# Altium project NavMergeBoard.PrjPcb
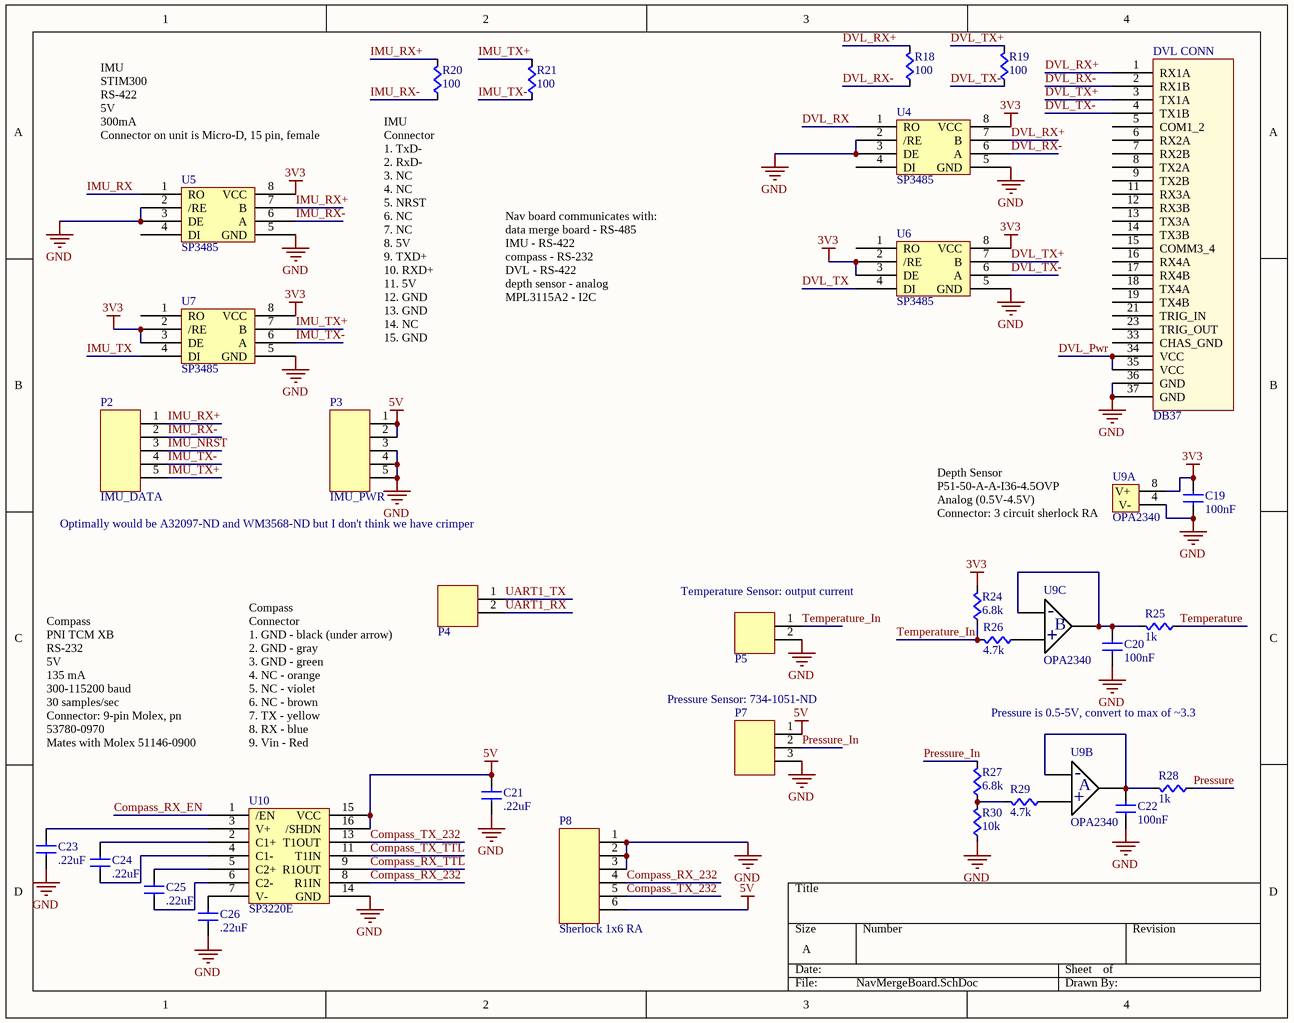
[diagram p0: NavMergeBoard.SchDoc]
4 sheets, 103 parts. Net scope: global (net labels, ports and power ports of the same name join across sheets).
Board files: NavMergeBoard.PcbDoc, NavMergeBoardR2.PcbDoc
Sheets:
  NavMergeBoard.SchDoc
  Power.SchDoc
  CPU.SchDoc
  LEDs.SchDoc

## Sheet NavMergeBoard.SchDoc
size A

### Parts
C19  value 100nF  [CAPC0603]  (hidden comment: Cap)
C20  value 100nF  [CAPC0603]  (hidden comment: Cap)
C21  value .22uF  [CAPC0603]  (hidden comment: Cap)
C22  value 100nF  [CAPC0603]  (hidden comment: Cap)
C23  value .22uF  [CAPC0603]  (hidden comment: Cap)
C24  value .22uF  [CAPC0603]  (hidden comment: Cap)
C25  value .22uF  [CAPC0603]  (hidden comment: Cap)
C26  value .22uF  [CAPC0603]  (hidden comment: Cap)
DVL_CONN  DB37  [DSUB37_ FEMALE]
P2  MOLEX-HDR-1x5-SHERLOCK_RA  [MOLEX-HDR-1X5-SHERLOCK- RA]  (value not drawn)
P3  MOLEX-HDR-1x5-SHERLOCK_RA  [MOLEX-HDR-1X5-SHERLOCK- RA]  (value not drawn)
P4  2-pin Horz Sherlock  [MOLEX-HDR-1X2-SHERLOCK-HORZ]  (value not drawn)
P5  2-pin Horz Sherlock  [MOLEX-HDR-1X2-SHERLOCK-HORZ]  (value not drawn)
P7  3pos RA sherlock connector  [MOLEX-HDR-1X3-SHERLOCK-RA]  (value not drawn)
P8  Sherlock 1x6 RA  [MOLEX-HDR-1X6-SHERLOCK- RA]
R18  value 100  [RES0603]  (hidden comment: Res)
R19  value 100  [RES0603]  (hidden comment: Res)
R20  value 100  [RES0603]  (hidden comment: Res)
R21  value 100  [RES0603]  (hidden comment: Res)
R24  value 6.8k  [RES0603]  (hidden comment: Res)
R25  value 1k  [RES0603]  (hidden comment: Res)
R26  value 4.7k  [RES0603]  (hidden comment: Res)
R27  value 6.8k  [RES0603]  (hidden comment: Res)
R28  value 1k  [RES0603]  (hidden comment: Res)
R29  value 4.7k  [RES0603]  (hidden comment: Res)
R30  value 10k  [RES0603]  (hidden comment: Res)
U4  SP3485  [SP3485]
U5  SP3485  [SP3485]
U6  SP3485  [SP3485]
U7  SP3485  [SP3485]
U9  OPA2340  [OPA2340]  (parts A,B,C of 3)
U10  SP3220E  [SP3220ECY-L/TR]

### Nets
3V3: C19.1(A) R24.1(A) U4.8(VCC) U5.8(VCC) U6.2(/RE) U6.3(DE) U6.8(VCC) U7.2(/RE) U7.3(DE) U7.8(VCC) U9.8(V+)
5V: C21.1(A) P3.1 P3.2 P7.1 P8.6 U10.15(VCC) U10.16(/SHDN)
GND: C19.2(B) C20.2(B) C21.2(B) C22.2(B) C23.2(B) C26.2(B) DVL_CONN.36(GND) DVL_CONN.37(GND) P3.3 P3.4 P3.5 P5.2 P7.3 P8.1 P8.2 P8.3 R30.2(B) U4.2(/RE) U4.3(DE) U4.5(GND) U5.2(/RE) U5.3(DE) U5.5(GND) U6.5(GND) U7.5(GND) U9.4(V-) U10.14(GND)
Compass_RX_232: P8.4 U10.8(R1IN)
Compass_RX_EN: U10.1(/EN)
Compass_RX_TTL: U10.9(R1OUT)
Compass_TX_232: P8.5 U10.13(T1OUT)
Compass_TX_TTL: U10.11(T1IN)
DVL_Pwr: DVL_CONN.34(VCC) DVL_CONN.35(VCC)
DVL_RX: U4.1(RO)
DVL_RX+: DVL_CONN.1(RX1A) R18.1(A) U4.7(B)
DVL_RX-: DVL_CONN.2(RX1B) R18.2(B) U4.6(A)
DVL_TX: U6.4(DI)
DVL_TX+: DVL_CONN.3(TX1A) R19.1(A) U6.7(B)
DVL_TX-: DVL_CONN.4(TX1B) R19.2(B) U6.6(A)
IMU_NRST: P2.3
IMU_RX: U5.1(RO)
IMU_RX+: P2.1 R20.1(A) U5.7(B)
IMU_RX-: P2.2 R20.2(B) U5.6(A)
IMU_TX: U7.4(DI)
IMU_TX+: P2.5 R21.1(A) U7.7(B)
IMU_TX-: P2.4 R21.2(B) U7.6(A)
Pressure: R28.2(B)
Pressure_In: P7.2 R27.1(A)
Temperature: R25.2(B)
Temperature_In: P5.1 R24.2(B) R26.1(A)
UART1_RX: P4.2
UART1_TX: P4.1
NetC20_1: C20.1(A) R25.1(A) U9.6(BIn-) U9.7(BOut)
NetC22_1: C22.1(A) R28.1(A) U9.1(AOut) U9.2(AIn-)
NetC23_1: C23.1(A) U10.3(V+)
NetC24_1: C24.1(A) U10.2(C1+)
NetC24_2: C24.2(B) U10.4(C1-)
NetC25_1: C25.1(A) U10.5(C2+)
NetC25_2: C25.2(B) U10.6(C2-)
NetC26_1: C26.1(A) U10.7(V-)
NetR26_2: R26.2(B) U9.5(BIn+)
NetR27_2: R27.2(B) R29.1(A) R30.1(A)
NetR29_2: R29.2(B) U9.3(AIn+)

Not connected (* = marked no-connect by the designer): DVL_CONN 5(COM1_2) 6(RX2A) 7(RX2B) 8(TX2A) 9(TX2B) 11(RX3A) 12(RX3B) 13(TX3A) 14(TX3B) 15(COMM3_4) 16(RX4A) 17(RX4B) 18(TX4A) 19(TX4B) 21(TRIG_IN) 23(TRIG_OUT) 33(CHAS_GND); U4 4(DI); U5 4(DI); U6 1(RO); U7 1(RO)

### Notes on the sheet
- (near U5) IMU
  STIM300
  RS-422
  5V
  300mA
  Connector on unit is Micro-D, 15 pin, female
- (near R20) IMU Connector
  1. TxD-
  2. RxD-
  3. NC
  4. NC
  5. NRST
  6. NC
  7. NC
  8. 5V
  9. TXD+
  10. RXD+
  11. 5V
  12. GND
  13. GND
  14. NC
  15. GND
- Nav board communicates with:
  data merge board - RS-485
  IMU - RS-422
  compass - RS-232
  DVL - RS-422
  depth sensor - analog
  MPL3115A2 - I2C
- (near P2) IMU_DATA
- (near P3) IMU_PWR
- Optimally would be A32097-ND and WM3568-ND but I don't think we have crimper
- Depth Sensor
  P51-50-A-A-I36-4.5OVP
  Analog (0.5V-4.5V)
  Connector: 3 circuit sherlock RA
- (near P5) Temperature Sensor: output current
- (near P7) Pressure Sensor: 734-1051-ND
- Compass
  PNI TCM XB
  RS-232
  5V
  135 mA
  300-115200 baud
  30 samples/sec
  Connector: 9-pin Molex, pn 53780-0970
  Mates with Molex 51146-0900
- Compass
  Connector
  1. GND - black (under arrow)
  2. GND - gray
  3. GND - green
  4. NC - orange
  5. NC - violet
  6. NC - brown
  7. TX - yellow
  8. RX - blue
  9. Vin - Red
- Pressure is 0.5-5V, convert to max of ~3.3
- (in symbol OPA2340, part B) -; A; +
- (in symbol OPA2340, part C) -; B; +

### Library data of the parts
DVL_CONN = DVLCONN: DVL Connector using DSUB37; Manufacturer: FCI; Manufacturer Part Number: 10090098-S374VLF; Supplier 1: Digikey; Supplier Part Number 1: 609-4001-ND
P2 P3 = MOLEX-HDR-1x5-SHERLOCK_RA: Header, Molex, 2mm Pitch Sherlock Header, Single Row, Vertical, 5 Circuits, Length 3.3mm, 0353620550; Manufacturer Part Number: 0353630560; Supplier Part Number 1: WM18934-ND; Supplier 1: Digikey; Manufacturer: Molex
P4 P5 = MOLEX-HDR-1x2-SHERLOCK_RA: Header, Molex, 2mm Pitch Sherlock Header, Single Row, Horizontal, 2 Circuits, Length 3.3mm,  0353630260; Manufacturer: Molex Inc; Manufacturer Part Number: 0353630260; Supplier Part Number 1: WM18931-ND; Supplier 1: Digi-Key
P7 = MOLEX-HDR-1x3-SHERLOCK_RA: Header, Molex, 2mm Pitch Sherlock Header, Single Row, Right Angle 3 Circuits, Length 3.3mm; Manufacturer Part Number: 35363-0360; Manufacturer: Molex Connector Corporation; Supplier Part Number 1: WM18932-ND; Supplier 1: Digi-Key
P8 = MOLEX-HDR-1x6-SHERLOCK_RA: CONN HEADER 6POS 2MM R/A TIN; Supplier 1: Digi-Key; Supplier Part Number 1: WM18935-ND
U4-U7 = SP3485: IC TXRX RS485 HALF DUPLEX 8NSOIC; Supplier 1: Digi-Key; Supplier Part Number 1: 1016-1817-1-ND
U9 = OPA2340: IC OPAMP GP 5.5MHZ RRO 8SOIC; Supplier 1: Digi-Key; Supplier Part Number 1: 296-26254-1-ND
U10 = SP3220E: IC DVR/RCVR RS232 ESD 16TSSOP; Supplier 1: Digi-Key; Supplier Part Number 1: 1016-1920-1-ND
C19-C26 = Cap: Supplier 1: Digi-Key
  C19 C20 C22: Supplier Part Number 1: 1276-1000-1-ND
  C21 C23-C26: Supplier Part Number 1: 587-1246-1-ND
R18-R21 R24-R30 = Res: Supplier 1: Digi-Key
  R18-R21: Supplier Part Number 1: P100GCT-ND
  R24 R27: Supplier Part Number 1: RHM6.8KCFCT-ND
  R25 R28: Supplier Part Number 1: P1.0KGCT-ND
  R26 R29: Supplier Part Number 1: P4.7KGCT-ND
  R30: Supplier Part Number 1: RMCF0603JT10K0CT-ND

## Sheet Power.SchDoc
size A
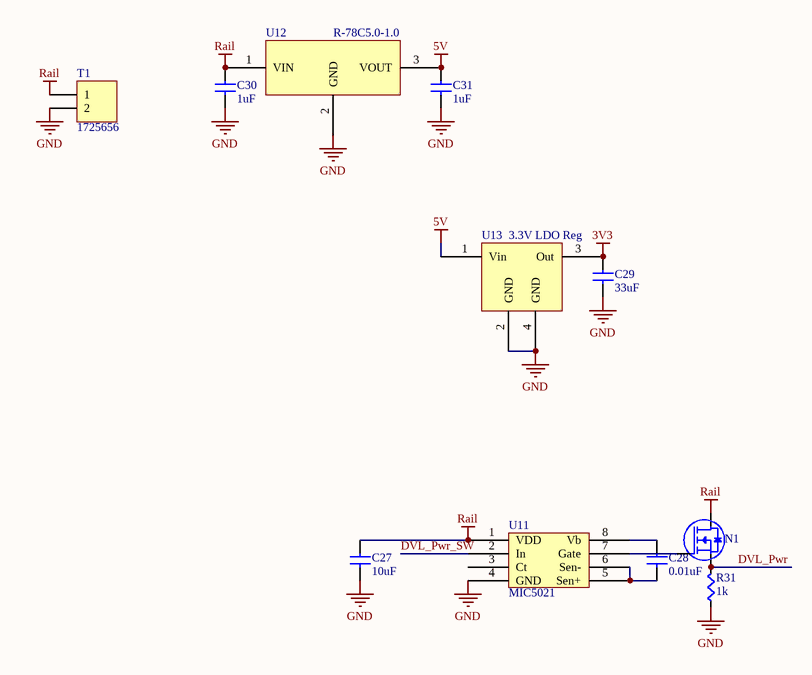
[diagram p1: Power.SchDoc]

### Parts
C27  value 10uF  [CAPC0805]  (hidden comment: Cap)
C28  value 0.01uF  [CAPC0805]  (hidden comment: Cap)
C29  value 33uF  [CAPC1206]  (hidden comment: Cap)
C30  value 1uF  [CAPC0603]  (hidden comment: Cap)
C31  value 1uF  [CAPC0603]  (hidden comment: Cap)
N1  NMOSFET_TO-220  [TO-220AB Heatsink]  (value not drawn)
R31  value 1k  [RES0603]  (hidden comment: Res)
T1  1725656  [1725656]
U11  MIC5021  [MIC5021]
U12  R-78C5.0-1.0  [R-78C5.0-1.0]
U13  3.3V LDO Reg  [SOT23-4n]

### Nets
3V3: C29.1(A) U13.3(Out)
5V: C31.1(A) U12.3(VOUT) U13.1(Vin)
GND: C27.2(B) C29.2(B) C30.2(B) C31.2(B) R31.2(B) T1.2 U11.4(GND) U12.2(GND) U13.2(GND) U13.4(GND)
Rail: C27.1(A) C30.1(A) N1.D T1.1 U11.1(VDD) U12.1(VIN)
DVL_Pwr: N1.S R31.1(A)
DVL_Pwr_SW: U11.2(In)
NetC28_1: C28.1(A) U11.8(Vb)
NetC28_2: C28.2(B) U11.5(Sen+) U11.6(Sen-)
NetN1_G: N1.G U11.7(Gate)

Not connected (* = marked no-connect by the designer): U11 3(Ct)

### Library data of the parts
N1 = NMOSFET_TO-220: NMOSFET_TO-220-Template; Supplier 1: Digi-Key; Supplier Part Number 1: IRLB3813PBF-ND
T1 = 1725656: CONN TERM BLOCK 2.54MM 2POS; Supplier 1: Digi-Key; Supplier Part Number 1: 277-1273-ND
U11 = MIC5021: IC DRIVER MOSFET HISIDE HS 8SOIC; Supplier 1: Digi-Key; Supplier Part Number 1: 576-1239-1-ND
U12 = R-78C5.0-1.0: CONV DC/DC 1A 5V OUT SIP VERT; Supplier 1: Digi-Key; Supplier Part Number 1: 945-1395-5-ND
U13 = LM3940IMPX-3.3: IC REG LDO 3.3V 1A SOT223; Supplier 1: Digi-Key; Supplier Part Number 1: LM3940IMPX-3.3/NOPBCT-ND
C27-C31 = Cap: Supplier 1: Digi-Key
  C27: Supplier Part Number 1: 445-14417-1-ND
  C28: Supplier Part Number 1: 490-1664-1-ND
  C29: Supplier Part Number 1: 445-4060-1-ND
  C30: Supplier Part Number 1: 587-2400-1-ND
  C31: Supplier Part Number 1: 1276-1946-1-ND
R31 = Res: Supplier 1: Digi-Key; Supplier Part Number 1: P1.0KGCT-ND

## Sheet CPU.SchDoc
size A
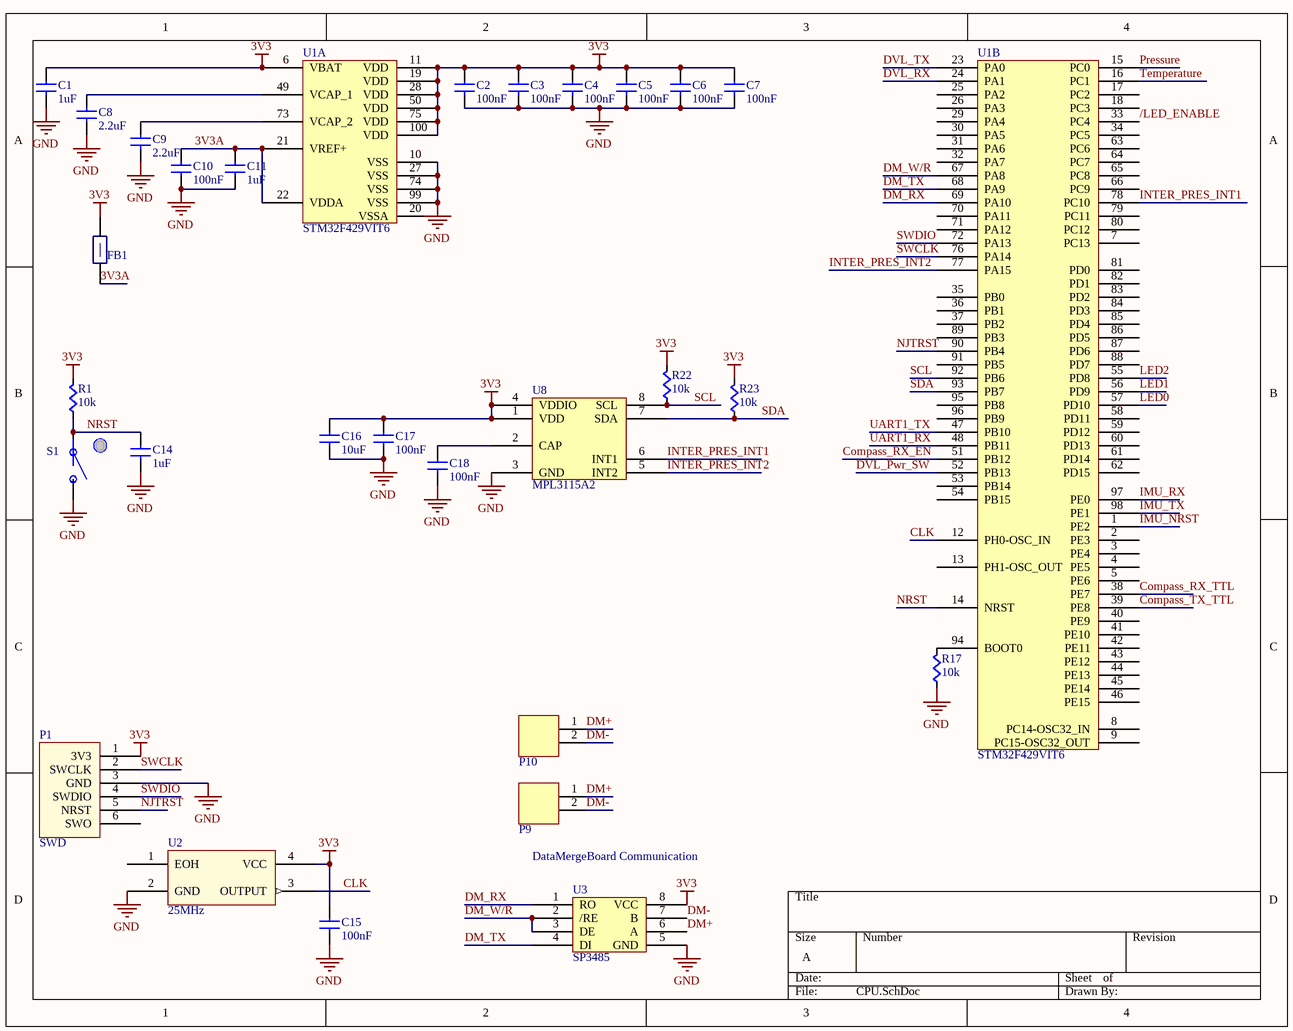
[diagram p2: CPU.SchDoc]

### Parts
C1  value 1uF  [CAPC0603]  (hidden comment: Cap)
C2  value 100nF  [CAPC0603]  (hidden comment: Cap)
C3  value 100nF  [CAPC0603]  (hidden comment: Cap)
C4  value 100nF  [CAPC0603]  (hidden comment: Cap)
C5  value 100nF  [CAPC0603]  (hidden comment: Cap)
C6  value 100nF  [CAPC0603]  (hidden comment: Cap)
C7  value 100nF  [CAPC0603]  (hidden comment: Cap)
C8  value 2.2uF  [CAPC0603]  (hidden comment: Cap)
C9  value 2.2uF  [CAPC0603]  (hidden comment: Cap)
C10  value 100nF  [CAPC0603]  (hidden comment: Cap)
C11  value 1uF  [CAPC0603]  (hidden comment: Cap)
C14  value 1uF  [CAPC0603]  (hidden comment: Cap)
C15  value 100nF  [CAPC0603]  (hidden comment: Cap)
C16  value 10uF  [CAPC0603]  (hidden comment: Cap)
C17  value 100nF  [CAPC0603]  (hidden comment: Cap)
C18  value 100nF  [CAPC0603]  (hidden comment: Cap)
FB1  FBead  [RES0603]  (value not drawn)
P1  SWD  [SWD_STM32]
P9  2-pin Horz Sherlock  [MOLEX-HDR-1X2-SHERLOCK-HORZ]  (value not drawn)
P10  2-pin Horz Sherlock  [MOLEX-HDR-1X2-SHERLOCK-HORZ]  (value not drawn)
R1  value 10k  [RES0603]  (hidden comment: Res)
R17  value 10k  [RES0603]  (hidden comment: Res)
R22  value 10k  [RES0603]  (hidden comment: Res)
R23  value 10k  [RES0603]  (hidden comment: Res)
S1  Button  [PTS645xxxxSMTR92]  (value not drawn)
U1  STM32F429VIT6  [STM32F429VIT6]  (parts A,B of 2)
U2  25MHz  [636L3C]
U3  SP3485  [SP3485]
U8  MPL3115A2  [MPL3115A2]

### Nets
3V3: C1.1(A) C2.1(A) C3.1(A) C4.1(A) C5.1(A) C6.1(A) C7.1(A) C15.1(A) C16.1(A) C17.1(A) FB1.2(B) P1.1(3V3) R1.1(A) R22.1(A) R23.1(A) U1.6(VBAT) U1.11(VDD) U1.19(VDD) U1.28(VDD) U1.50(VDD) U1.75(VDD) U1.100(VDD) U2.4(VCC) U3.8(VCC) U8.1(VDD) U8.4(VDDIO)
GND: C1.2(B) C2.2(B) C3.2(B) C4.2(B) C5.2(B) C6.2(B) C7.2(B) C8.2(B) C9.2(B) C10.2(B) C11.2(B) C14.2(B) C15.2(B) C16.2(B) C17.2(B) C18.2(B) P1.3(GND) R17.2(B) S1.B U1.10(VSS) U1.27(VSS) U1.74(VSS) U1.99(VSS) U2.2(GND) U3.5(GND) U8.3(GND)
3V3A: C10.1(A) C11.1(A) FB1.1(A) U1.21(VREF+) U1.22(VDDA)
/LED_ENABLE: U1.33(PC4)
CLK: U1.12(PH0-OSC_IN) U2.3(OUTPUT)
Compass_RX_EN: U1.51(PB12)
Compass_RX_TTL: U1.38(PE7)
Compass_TX_TTL: U1.39(PE8)
DM+: P9.1 P10.1 U3.6(A)
DM-: P9.2 P10.2 U3.7(B)
DM_RX: U1.69(PA10) U3.1(RO)
DM_TX: U1.68(PA9) U3.4(DI)
DM_W/R: U1.67(PA8) U3.2(/RE) U3.3(DE)
DVL_Pwr_SW: U1.52(PB13)
DVL_RX: U1.24(PA1)
DVL_TX: U1.23(PA0)
IMU_NRST: U1.1(PE2)
IMU_RX: U1.97(PE0)
IMU_TX: U1.98(PE1)
INTER_PRES_INT1: U1.78(PC10) U8.6(INT1)
INTER_PRES_INT2: U1.77(PA15) U8.5(INT2)
LED0: U1.57(PD10)
LED1: U1.56(PD9)
LED2: U1.55(PD8)
NJTRST: P1.5(NRST) U1.90(PB4)
NRST: C14.1(A) R1.2(B) S1.A U1.14(NRST)
Pressure: U1.15(PC0)
SCL: R22.2(B) U1.92(PB6) U8.8(SCL)
SDA: R23.2(B) U1.93(PB7) U8.7(SDA)
SWCLK: P1.2(SWCLK) U1.76(PA14)
SWDIO: P1.4(SWDIO) U1.72(PA13)
Temperature: U1.16(PC1)
UART1_RX: U1.48(PB11)
UART1_TX: U1.47(PB10)
NetC8_1: C8.1(A) U1.49(VCAP_1)
NetC9_1: C9.1(A) U1.73(VCAP_2)
NetC18_1: C18.1(A) U8.2(CAP)
NetR17_1: R17.1(A) U1.94(BOOT0)

Not connected (* = marked no-connect by the designer): P1 6(SWO); U1 2(PE3) 3(PE4) 4(PE5) 5(PE6) 7(PC13) 8(PC14-OSC32_IN) 9(PC15-OSC32_OUT) 13(PH1-OSC_OUT) 17(PC2) 18(PC3) 20(VSSA) 25(PA2) 26(PA3) 29(PA4) 30(PA5) 31(PA6) 32(PA7) 34(PC5) 35(PB0) 36(PB1) 37(PB2) 40(PE9) 41(PE10) 42(PE11) 43(PE12) 44(PE13) 45(PE14) 46(PE15) 53(PB14) 54(PB15) 58(PD11) 59(PD12) 60(PD13) 61(PD14) 62(PD15) 63(PC6) 64(PC7) 65(PC8) 66(PC9) 70(PA11) 71(PA12) 79(PC11) 80(PC12) 81(PD0) 82(PD1) 83(PD2) 84(PD3) 85(PD4) 86(PD5) 87(PD6) 88(PD7) 89(PB3) 91(PB5) 95(PB8) 96(PB9); U2 1(EOH)

### Notes on the sheet
- DataMergeBoard Communication

### Library data of the parts
FB1 = FBead: Ferrite Bead; Supplier 1: Digi-Key; Supplier Part Number 1: 445-2988-1-ND
P1 = SWD_STM32: SWD connector matching the pinout on STM Discovery Boards
P9 P10 = MOLEX-HDR-1x2-SHERLOCK_RA: as P4 on sheet NavMergeBoard; Manufacturer Part Number: 0353630260; Supplier Part Number 1: WM18931-ND; Supplier 1: Digi-Key
S1 = Button: SPST Button; Supplier 1: Digi-Key; Supplier Part Number 1: CKN9087CT-ND
U1 = STM32F429VIT6: IC MCU ARM 2MB FLASH 100LQFP; Supplier 1: Digi-Key; Supplier Part Number 1: 497-14052-ND
U2 = 636L3C: HCMOS/TTL Clock Oscillator; Supplier 1: Digi-Key; Supplier Part Number 1: CTX697CT-ND
U3 = SP3485: IC TXRX RS485 HALF DUPLEX 8NSOIC; Supplier 1: Digi-Key; Supplier Part Number 1: 1016-1817-1-ND
U8 = MPL3115A2: IC ALTIMETER I2C VERSION 8LGA; Supplier 1: Digi-Key; Supplier Part Number 1: MPL3115A2R1CT-ND
C1-C11 C14-C18 = Cap: Supplier 1: Digi-Key
  C1 C11 C14: Supplier Part Number 1: 1276-1946-1-ND
  C2-C7 C10 C15 C17 C18: Supplier Part Number 1: 1276-1000-1-ND
  C8 C9: Supplier Part Number 1: 587-1254-1-ND
  C16: Supplier Part Number 1: 490-6405-1-ND
R1 R17 R22 R23 = Res: Supplier 1: Digi-Key; Supplier Part Number 1: RMCF0603JT10K0CT-ND

## Sheet LEDs.SchDoc
size A
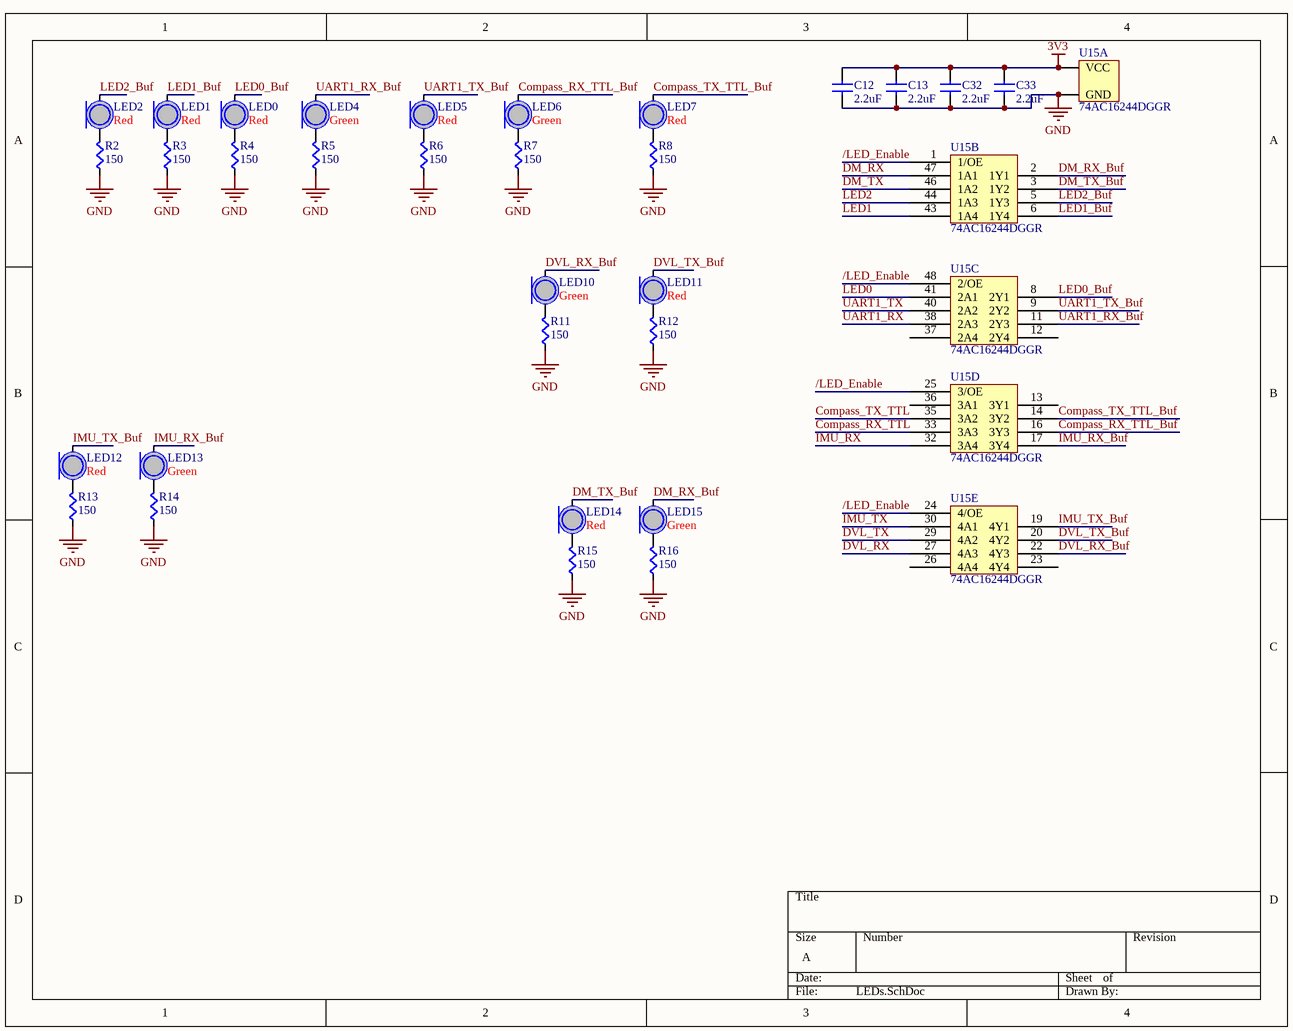
[diagram p3: LEDs.SchDoc]

### Parts
C12  value 2.2uF  [CAPC0603]  (hidden comment: Cap)
C13  value 2.2uF  [CAPC0603]  (hidden comment: Cap)
C32  value 2.2uF  [CAPC0603]  (hidden comment: Cap)
C33  value 2.2uF  [CAPC0603]  (hidden comment: Cap)
LED0  Color: Red  [LED0603]  (hidden comment: LED)
LED1  Color: Red  [LED0603]  (hidden comment: LED)
LED2  Color: Red  [LED0603]  (hidden comment: LED)
LED4  Color: Green  [LED0603]  (hidden comment: LED)
LED5  Color: Red  [LED0603]  (hidden comment: LED)
LED6  Color: Green  [LED0603]  (hidden comment: LED)
LED7  Color: Red  [LED0603]  (hidden comment: LED)
LED10  Color: Green  [LED0603]  (hidden comment: LED)
LED11  Color: Red  [LED0603]  (hidden comment: LED)
LED12  Color: Red  [LED0603]  (hidden comment: LED)
LED13  Color: Green  [LED0603]  (hidden comment: LED)
LED14  Color: Red  [LED0603]  (hidden comment: LED)
LED15  Color: Green  [LED0603]  (hidden comment: LED)
R2  value 150  [RES0603]  (hidden comment: Res)
R3  value 150  [RES0603]  (hidden comment: Res)
R4  value 150  [RES0603]  (hidden comment: Res)
R5  value 150  [RES0603]  (hidden comment: Res)
R6  value 150  [RES0603]  (hidden comment: Res)
R7  value 150  [RES0603]  (hidden comment: Res)
R8  value 150  [RES0603]  (hidden comment: Res)
R11  value 150  [RES0603]  (hidden comment: Res)
R12  value 150  [RES0603]  (hidden comment: Res)
R13  value 150  [RES0603]  (hidden comment: Res)
R14  value 150  [RES0603]  (hidden comment: Res)
R15  value 150  [RES0603]  (hidden comment: Res)
R16  value 150  [RES0603]  (hidden comment: Res)
U15  74AC16244DGGR  (parts A,B,C,D,E of 5)

### Nets
3V3: C12.1(A) C13.1(A) C32.1(A) C33.1(A) U15.VCC
GND: C12.2(B) C13.2(B) C32.2(B) C33.2(B) R2.2(B) R3.2(B) R4.2(B) R5.2(B) R6.2(B) R7.2(B) R8.2(B) R11.2(B) R12.2(B) R13.2(B) R14.2(B) R15.2(B) R16.2(B) U15.GND
/LED_ENABLE: U15.1(1/OE) U15.24(4/OE) U15.25(3/OE) U15.48(2/OE)
Compass_RX_TTL: U15.33(3A3)
Compass_RX_TTL_Buf: LED6.A U15.16(3Y3)
Compass_TX_TTL: U15.35(3A2)
Compass_TX_TTL_Buf: LED7.A U15.14(3Y2)
DM_RX: U15.47(1A1)
DM_RX_Buf: LED15.A U15.2(1Y1)
DM_TX: U15.46(1A2)
DM_TX_Buf: LED14.A U15.3(1Y2)
DVL_RX: U15.27(4A3)
DVL_RX_Buf: LED10.A U15.22(4Y3)
DVL_TX: U15.29(4A2)
DVL_TX_Buf: LED11.A U15.20(4Y2)
IMU_RX: U15.32(3A4)
IMU_RX_Buf: LED13.A U15.17(3Y4)
IMU_TX: U15.30(4A1)
IMU_TX_Buf: LED12.A U15.19(4Y1)
LED0: U15.41(2A1)
LED0_Buf: LED0.A U15.8(2Y1)
LED1: U15.43(1A4)
LED1_Buf: LED1.A U15.6(1Y4)
LED2: U15.44(1A3)
LED2_Buf: LED2.A U15.5(1Y3)
UART1_RX: U15.38(2A3)
UART1_RX_Buf: LED4.A U15.11(2Y3)
UART1_TX: U15.40(2A2)
UART1_TX_Buf: LED5.A U15.9(2Y2)
NetLED0_C: LED0.C R4.1(A)
NetLED1_C: LED1.C R3.1(A)
NetLED2_C: LED2.C R2.1(A)
NetLED4_C: LED4.C R5.1(A)
NetLED5_C: LED5.C R6.1(A)
NetLED6_C: LED6.C R7.1(A)
NetLED7_C: LED7.C R8.1(A)
NetLED10_C: LED10.C R11.1(A)
NetLED11_C: LED11.C R12.1(A)
NetLED12_C: LED12.C R13.1(A)
NetLED13_C: LED13.C R14.1(A)
NetLED14_C: LED14.C R15.1(A)
NetLED15_C: LED15.C R16.1(A)

Not connected (* = marked no-connect by the designer): U15 12(2Y4) 13(3Y1) 23(4Y4) 26(4A4) 36(3A1) 37(2A4)

### Library data of the parts
U15 = 74AC16244DGGR: IC BUFF/DVR TRI-ST 16BIT 48TSSOP; Supplier 1: Digi-Key; Supplier Part Number 1: 296-15845-1-ND
C12 C13 C32 C33 = Cap: Supplier 1: Digi-Key; Supplier Part Number 1: 587-1254-1-ND
LED0-LED2 LED4-LED7 LED10-LED15 = LED: Supplier 1: Digi-Key
  LED0-LED2 LED5 LED7 LED11 LED12 LED14: Supplier Part Number 1: 754-1122-1-ND
  LED4 LED6 LED10 LED13 LED15: Supplier Part Number 1: 160-1446-1-ND
R2-R8 R11-R16 = Res: Supplier 1: Digi-Key; Supplier Part Number 1: RHM150CFCT-ND

## Nets that join several sheets
3V3: NavMergeBoard (11 pins), Power (C29.1 U13.3), CPU (26 pins), LEDs (5 pins)
5V: NavMergeBoard (7 pins), Power (C31.1 U12.3 U13.1)
GND: NavMergeBoard (27 pins), Power (10 pins), CPU (26 pins), LEDs (18 pins)
/LED_ENABLE: CPU (U1.33), LEDs (U15.1 U15.24 U15.25 U15.48)
Compass_RX_EN: NavMergeBoard (U10.1), CPU (U1.51)
Compass_RX_TTL: NavMergeBoard (U10.9), CPU (U1.38), LEDs (U15.33)
Compass_TX_TTL: NavMergeBoard (U10.11), CPU (U1.39), LEDs (U15.35)
DM_RX: CPU (U1.69 U3.1), LEDs (U15.47)
DM_TX: CPU (U1.68 U3.4), LEDs (U15.46)
DVL_Pwr: NavMergeBoard (DVL_CONN.34 DVL_CONN.35), Power (N1.S R31.1)
DVL_Pwr_SW: Power (U11.2), CPU (U1.52)
DVL_RX: NavMergeBoard (U4.1), CPU (U1.24), LEDs (U15.27)
DVL_TX: NavMergeBoard (U6.4), CPU (U1.23), LEDs (U15.29)
IMU_NRST: NavMergeBoard (P2.3), CPU (U1.1)
IMU_RX: NavMergeBoard (U5.1), CPU (U1.97), LEDs (U15.32)
IMU_TX: NavMergeBoard (U7.4), CPU (U1.98), LEDs (U15.30)
LED0: CPU (U1.57), LEDs (U15.41)
LED1: CPU (U1.56), LEDs (U15.43)
LED2: CPU (U1.55), LEDs (U15.44)
Pressure: NavMergeBoard (R28.2), CPU (U1.15)
Temperature: NavMergeBoard (R25.2), CPU (U1.16)
UART1_RX: NavMergeBoard (P4.2), CPU (U1.48), LEDs (U15.38)
UART1_TX: NavMergeBoard (P4.1), CPU (U1.47), LEDs (U15.40)